# EAGLE design nrf24multipro (EAGLE 7.3.0)
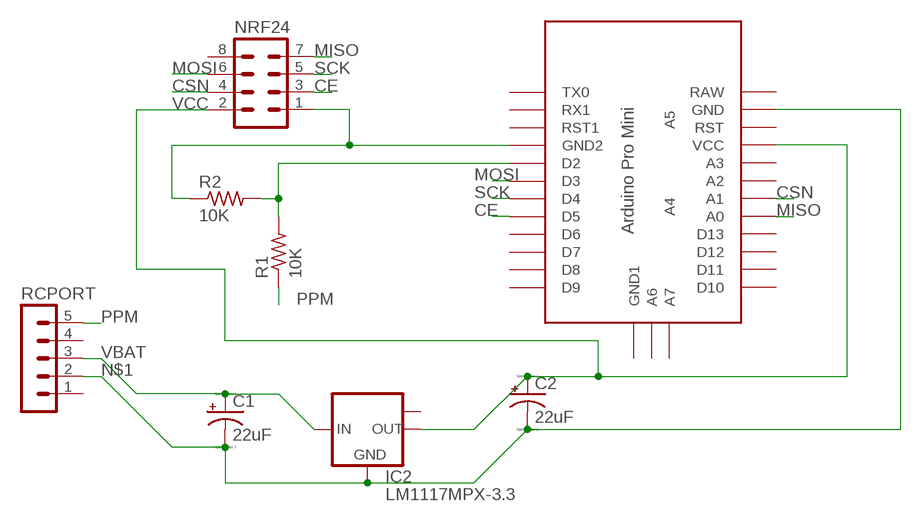
[diagram p0: schematic, sheet 1]

## Parts
C1  22uF  CPOL-USE1.8-4  [E1,8-4]
C2  22uF  CPOL-USE1.8-4  [E1,8-4]
IC2  LM1117MPX-3.3  [SOT223]
NRF24  MA04-2  [MA04-2]
R1  10K  R-US_0207/10  [0207/10]
R2  10K  R-US_0207/10  [0207/10]
RCPORT  MA05-1  [MA05-1]
U$1  ABK-PRO-MINI  [ABK-PRO-MINI]

## Nets
CE: NRF24.3 U$1.D5
CSN: NRF24.4 U$1.A1
MISO: NRF24.7 U$1.A0
MOSI: NRF24.6 U$1.D3
N$1: C1.- C2.- IC2.1(GND) RCPORT.2 U$1.GND
N$2: R1.2 R2.2 U$1.D2
N$3: NRF24.1 R2.1 U$1.GND1(GND2)
PPM: R1.1 RCPORT.5
SCK: NRF24.5 U$1.D4
VBAT: C1.+ IC2.3(IN) RCPORT.3
VCC: C2.+ IC2.2(OUT) NRF24.2 U$1.VCC
Unconnected: IC2.TAB(OUT1) NRF24.8 RCPORT.1 RCPORT.4 U$1.A2 U$1.A3 U$1.A4 U$1.A5 U$1.A6 U$1.A7 U$1.D6 U$1.D7 U$1.D8 U$1.D9 U$1.D10 U$1.D11 U$1.D12 U$1.D13 U$1.GND4(GND1) U$1.RAW U$1.RST U$1.RST1 U$1.RX1 U$1.TX0

## Library data of the parts
C1 C2 = resistor:CPOL-US: POLARIZED CAPACITOR, American symbol
IC2 = lm1117:LM1117MPX-*
NRF24 = con-lstb:MA04-2: PIN HEADER; OC_FARNELL: unknown; OC_NEWARK: unknown
R1 R2 = resistor:R-US_: RESISTOR, American symbol
RCPORT = con-lstb:MA05-1: PIN HEADER; OC_FARNELL: unknown; OC_NEWARK: unknown
U$1 = Arduino-clone-noheaders:ABK-PRO-MINI: ABK Pro-Mini Arduino Clone

## Board
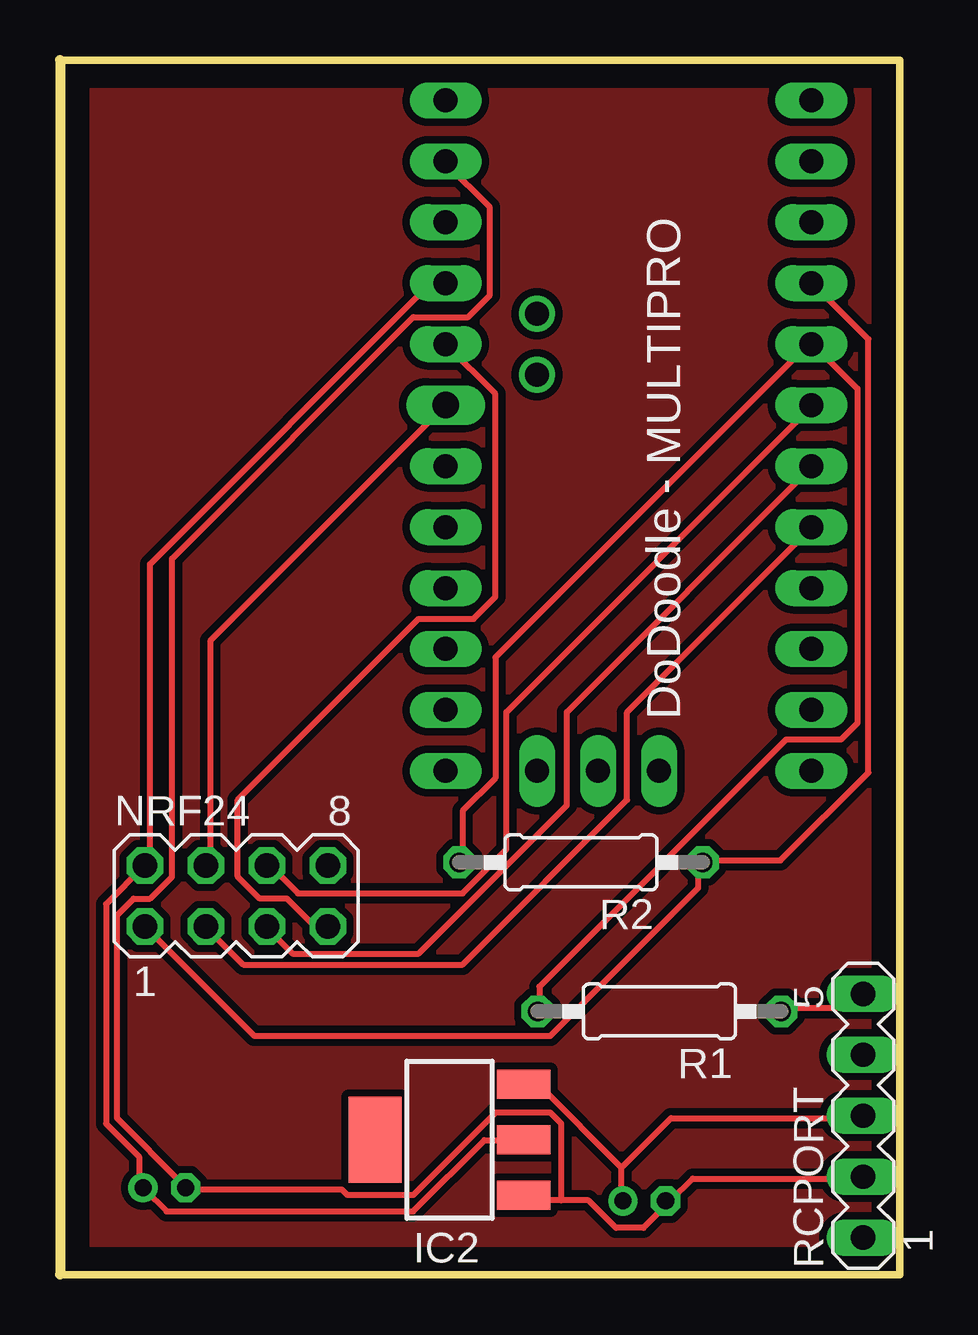
[diagram p1: board, top side]
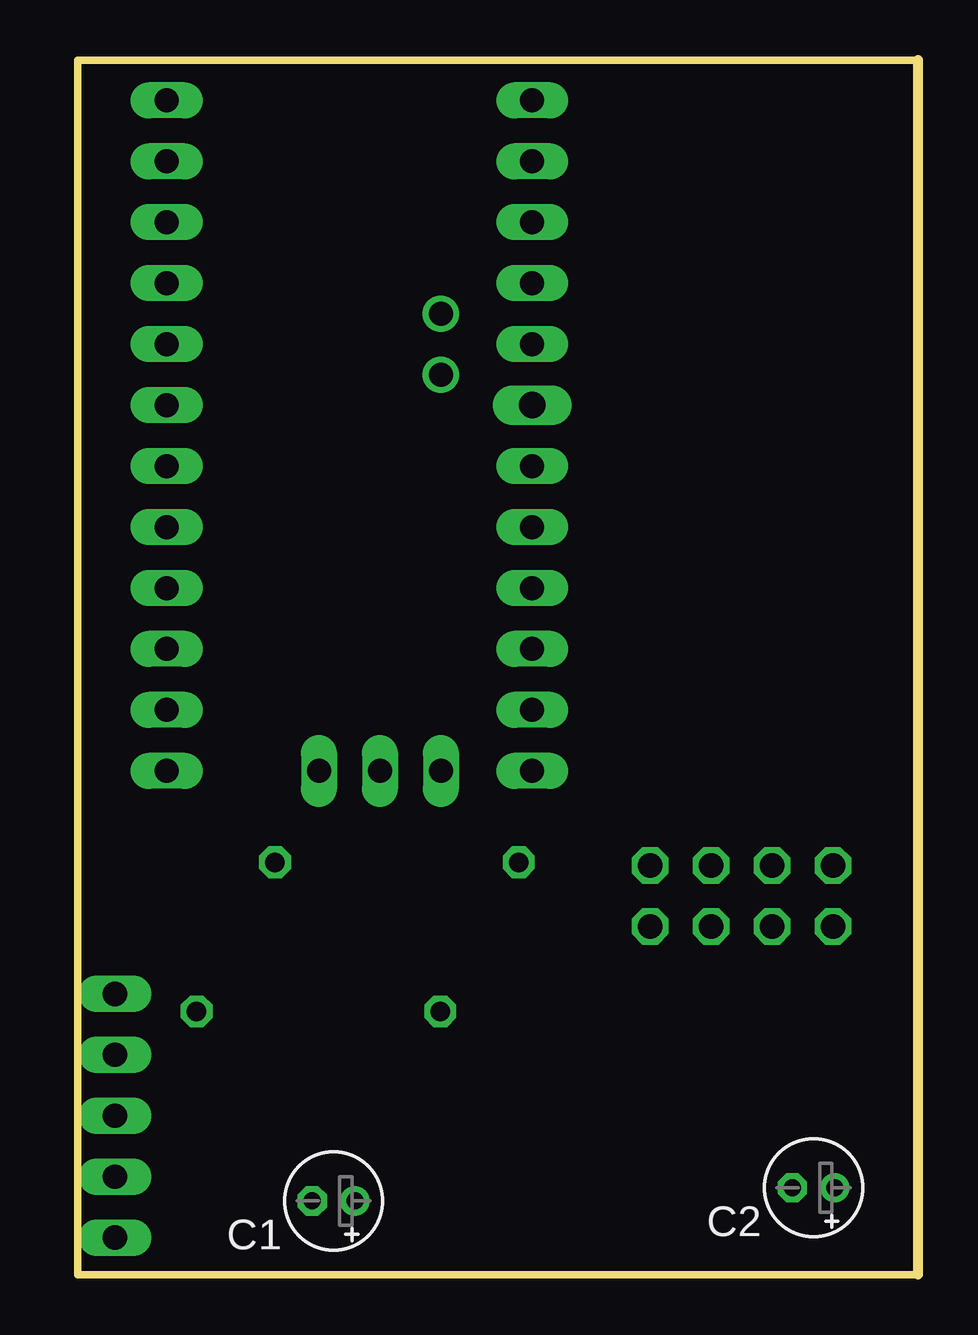
[diagram p2: board, bottom side, seen from below]

Size 35.02 x 50.61 mm. Coordinates in mm from the lower left corner, seen from the top.
Outline: 35.02,0 35.02,50.61 0,50.61 0,0 35.02,0
Copper layers (1+16): Top 0.035mm / dielectric 1.5mm / Bottom 0.035mm
Design rules "Mazzag_alterado *": minimum track width 12mil, minimum drill 26mil, track to track 12mil, track to pad 12mil, pad to pad 12mil, via to via 12mil, smd to smd 12mil, copper to edge 40mil, drill to drill 0.15mm, minimum pad ring 10mil, minimum via ring 10mil, stop-mask expansion 4mil, vias tented up to drill 0mil, thermal gap 10mil

### Footprints (pad centres in the part's own frame; a part is rotated, then mirrored left to right if it is on the bottom)
E1,8-4 = drill 0.711 pad 1.168: + -0.889,0 | drill 0.711 pad 1.168 octagon: - 0.889,0
SOT223 = smd 1.219 x 2.235: 1 -2.311,-3.099; 2 0,-3.099; 3 2.311,-3.099 | smd 3.6 x 2.2: TAB 0,3.099
MA04-2 = drill 1.016 octagon: 1 -3.81,-1.27; 2 -3.81,1.27; 3 -1.27,-1.27; 4 -1.27,1.27; 5 1.27,-1.27; 6 1.27,1.27; 7 3.81,-1.27; 8 3.81,1.27
0207/10 = drill 0.813 octagon: 1 -5.08,0; 2 5.08,0
MA05-1 = drill 1.016 long: 1 -5.08,0; 2 -2.54,0; 3 0,0; 4 2.54,0; 5 5.08,0
ABK-PRO-MINI = drill 1 long: A0 10.16,-3.81; A2 10.16,-8.89; A3 10.16,-11.43; A6 3.81,-21.59; A7 6.35,-21.59; D2 -5.08,-3.81; D3 -5.08,-6.35; D4 -5.08,-8.89; D5 -5.08,-11.43; D6 -5.08,-13.97; D7 -5.08,-16.51; D8 -5.08,-19.05; D9 -5.08,-21.59; D10 10.16,-21.59; D11 10.16,-19.05; D12 10.16,-16.51; D13 10.16,-13.97; GND 10.16,3.81; GND1 -5.08,-1.27; GND4 1.27,-21.59; RAW 10.16,6.35; RST 10.16,1.27; RST1 -5.08,1.27; RX1 -5.08,3.81; TX0 -5.08,6.35; VCC 10.16,-1.27 | drill 1.1 long: A1 10.16,-6.35 | drill 1: A4 6.35,-5.08; A5 6.35,-2.54

### Placement (x,y rotation side)
C1  24.36,3.07 180 bottom
C2  4.35,3.62 180 bottom
IC2  16.24,5.62 90 top
NRF24  7.35,15.78 0 top
R1  24.99,10.97 180 top
R2  21.72,17.18 180 top
RCPORT  33.48,6.62 90 top
U$1  26.24,42.58 0 bottom

### Tracks (layer width: path | path; a pad name or v marks a point on that pad's centre or on a via)
CE
  Top 0.254: U$1.D5 31.18,30.98 23.64,23.44 23.64,19.78 16.78,12.92 7.64,12.92 6.27,14.29 NRF24.3
CSN
  Top 0.254: NRF24.4 6.27,17.26 6.27,26.41 15.87,36.01 U$1.A1
GND
  pour Top: 0.52,50.46 34.52,50.46 34.52,49.46 34.52,0.46 0.52,0.46 0.52,1.46
MISO
  Top 0.254: U$1.A0 16.1,38.75 18.15,36.69 18.15,28.23 17.24,27.32 14.95,27.32 7.41,19.78 7.41,16.58 8.32,15.66 9.47,15.66 10.61,14.52 11.07,14.52 NRF24.7
MOSI
  Top 0.254: U$1.D3 31.18,36.01 18.61,23.44 18.61,17.72 16.78,15.89 9.93,15.89 8.78,17.03 NRF24.6
N$1
  Top 0.254: 20.9,3.09 22.04,3.09 23.18,1.95 24.33,1.95 25.24,2.86 C1.- 25.47,3.09 26.38,4 33.47,4 RCPORT.2 | 20.9,3.09 19.53,3.09 IC2.1 | 20.9,3.09 20.9,6.29 20.44,6.75 18.15,6.75 14.72,3.32 11.98,3.32 11.75,3.55 5.35,3.55 C2.- 5.12,3.78 2.38,6.52 2.38,14.98 3.07,15.66 3.75,15.66 4.67,16.58 4.67,29.84 14.72,39.89 17.01,39.89 17.93,40.81 17.93,44.47 16.1,46.3 U$1.GND
N$2
  Top 0.254: R1.2 19.98,11.09 19.98,12 30.27,22.29 32.56,22.29 33.24,22.98 33.24,36.92 31.41,38.75 U$1.D2 31.18,38.75 18.15,25.72 18.15,20.69 16.78,19.32 16.78,17.26 R2.2
N$3
  Top 0.254: NRF24.1 3.75,14.29 8.1,9.95 20.44,9.95 26.61,16.12 26.61,17.03 R2.1 26.84,17.26 30.04,17.26 33.7,20.92 33.7,38.98 31.41,41.27 U$1.GND1
PPM
  Top 0.254: R1.1 30.27,11.09 33.01,11.09 33.47,11.55 RCPORT.5
SCK
  Top 0.254: U$1.D4 31.18,33.49 21.13,23.44 21.13,19.55 14.95,13.38 9.7,13.38 8.78,14.29 NRF24.5
VBAT
  Top 0.254: 23.41,4.46 19.98,7.89 19.53,7.89 IC2.3 | 23.41,4.46 23.41,3.09 C1.+ | 23.41,4.46 25.47,6.52 33.47,6.52 RCPORT.3
VCC
  Top 0.254: IC2.2 19.3,5.6 17.7,5.6 14.72,2.63 4.44,2.63 3.52,3.55 C2.+ 3.29,3.78 3.29,4.92 1.92,6.29 1.92,15.43 NRF24.2 3.75,17.26 3.75,29.61 15.41,41.27 15.87,41.27 U$1.VCC

### Text on the board
tNames: DoDoodle - MULTIPRO